# EAGLE design main (EAGLE 9.4.1)
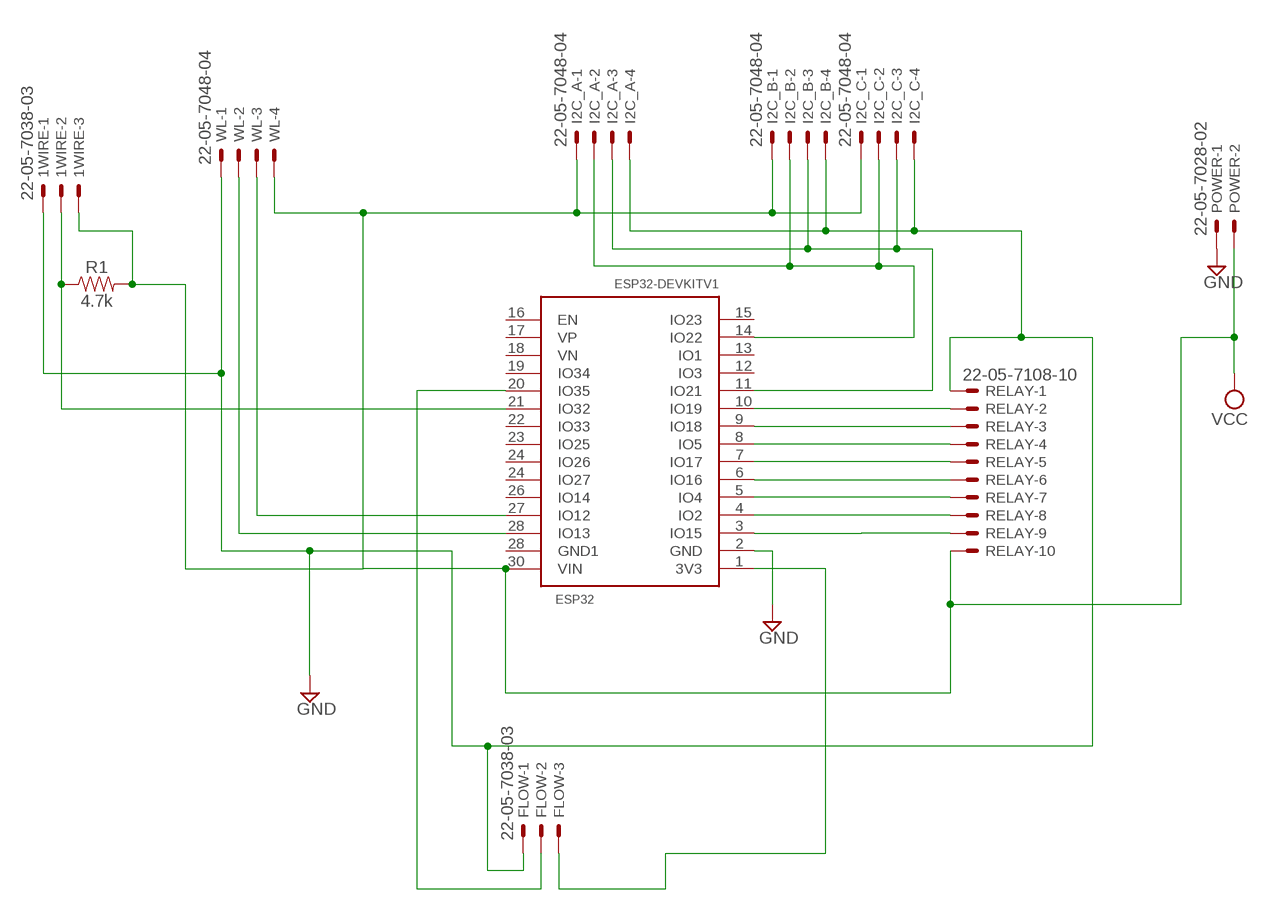
[diagram p0: schematic, sheet 1]

## Parts
1WIRE  22-05-7038-03  [7395-03]
ESP32  ESP32DEVKITV1  [ESP32-DEVKITV1]
FLOW  22-05-7038-03  [7395-03]
I2C_A  22-05-7048-04  [7395-04]
I2C_B  22-05-7048-04  [7395-04]
I2C_C  22-05-7048-04  [7395-04]
POWER  22-05-7028-02  [7395-02]
R1  4.7k  4.7KOHM-0603-1/10W-1%  [0603]
RELAY  22-05-7108-10  [7395-10]
WL  22-05-7048-04  [7395-04]

## Nets
GND: 1WIRE.1 ESP32.2(GND) FLOW.1 I2C_A.4 I2C_B.4 I2C_C.4 POWER.1 RELAY.1 WL.1
N$1: ESP32.3(IO15) RELAY.9
N$2: ESP32.4(IO2) RELAY.8
N$3: ESP32.5(IO4) RELAY.7
N$4: ESP32.6(IO16) RELAY.6
N$5: ESP32.7(IO17) RELAY.5
N$6: ESP32.8(IO5) RELAY.4
N$7: ESP32.9(IO18) RELAY.3
N$8: ESP32.10(IO19) RELAY.2
N$9: ESP32.27(IO12) WL.3
N$10: ESP32.28(IO13) WL.2
N$11: ESP32.11(IO21) I2C_A.3 I2C_B.3 I2C_C.3
N$12: ESP32.14(IO22) I2C_A.2 I2C_B.2 I2C_C.2
N$16: 1WIRE.2 ESP32.21(IO32) R1.1
N$17: ESP32.20(IO35) FLOW.2
N$21: ESP32.1(3V3) FLOW.3
VCC: 1WIRE.3 ESP32.30(VIN) I2C_A.1 I2C_B.1 I2C_C.1 POWER.2 R1.2 RELAY.10 WL.4
Unconnected: ESP32.12(IO3) ESP32.13(IO1) ESP32.15(IO23) ESP32.16(EN) ESP32.17(VP) ESP32.18(VN) ESP32.19(IO34) ESP32.22(IO33) ESP32.23(IO25) ESP32.24(IO26) ESP32.24(IO27) ESP32.26(IO14) ESP32.28(GND1)

## Library data of the parts
1WIRE FLOW = con-molex:22-?-03: CONNECTOR wire to board 2.54 mm (.1 inch) pitch header; MF: MOLEX; OC_FARNELL: unknown; OC_NEWARK: unknown
ESP32 = ESP32-DEVKITV1:ESP32DEVKITV1
I2C_A I2C_B I2C_C WL = con-molex:22-?-04: CONNECTOR wire to board 2.54 mm (.1 inch) pitch header; MF: MOLEX; OC_FARNELL: unknown; OC_NEWARK: unknown
POWER = con-molex:22-?-02: CONNECTOR wire to board 2.54 mm (.1 inch) pitch header; MF: MOLEX; OC_FARNELL: 9731601; OC_NEWARK: unknown
R1 = SparkFun-Resistors:4.7KOHM: 4.7kΩ resistor A resistor is a passive two-terminal electrical component that implements electrical resistance as a circuit element. Resistors act to reduce current flow, and, at the same time, act to lower voltage levels within circuits. - Wikipedia; PROD_ID: RES-07857
RELAY = con-molex:22-?-10: CONNECTOR wire to board 2.54 mm (.1 inch) pitch header; MF: MOLEX; OC_FARNELL: unknown; OC_NEWARK: unknown

## Board
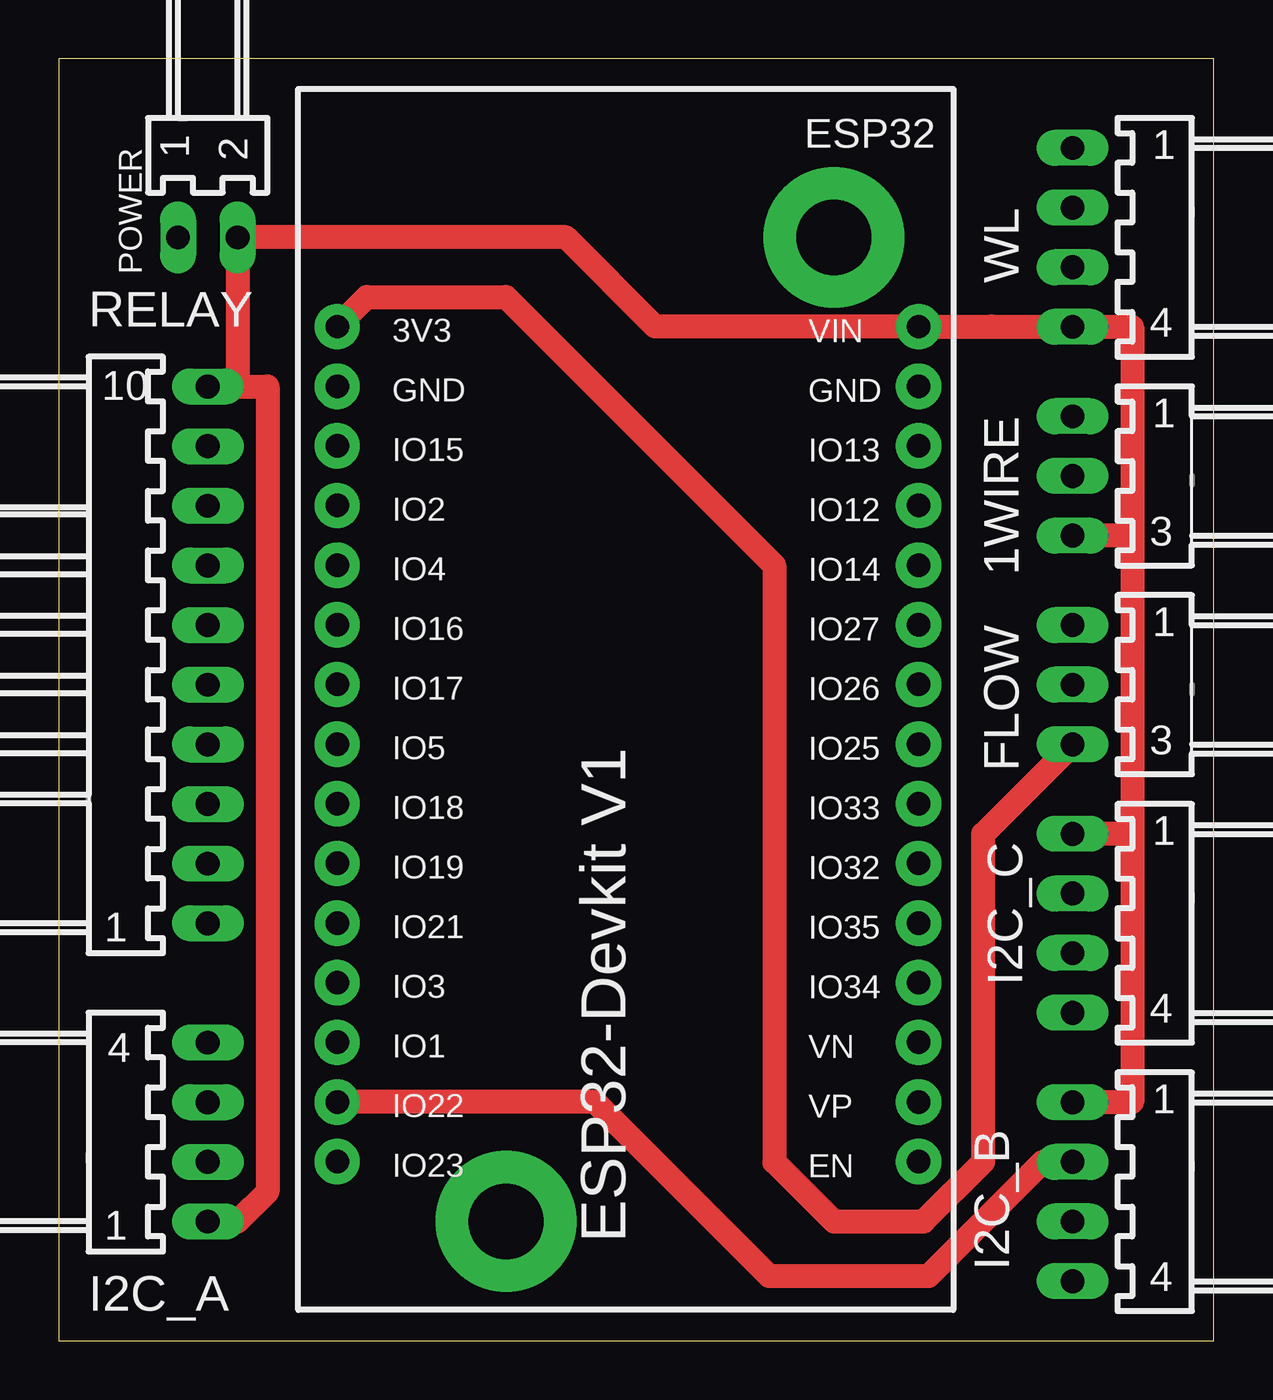
[diagram p1: board, top side]
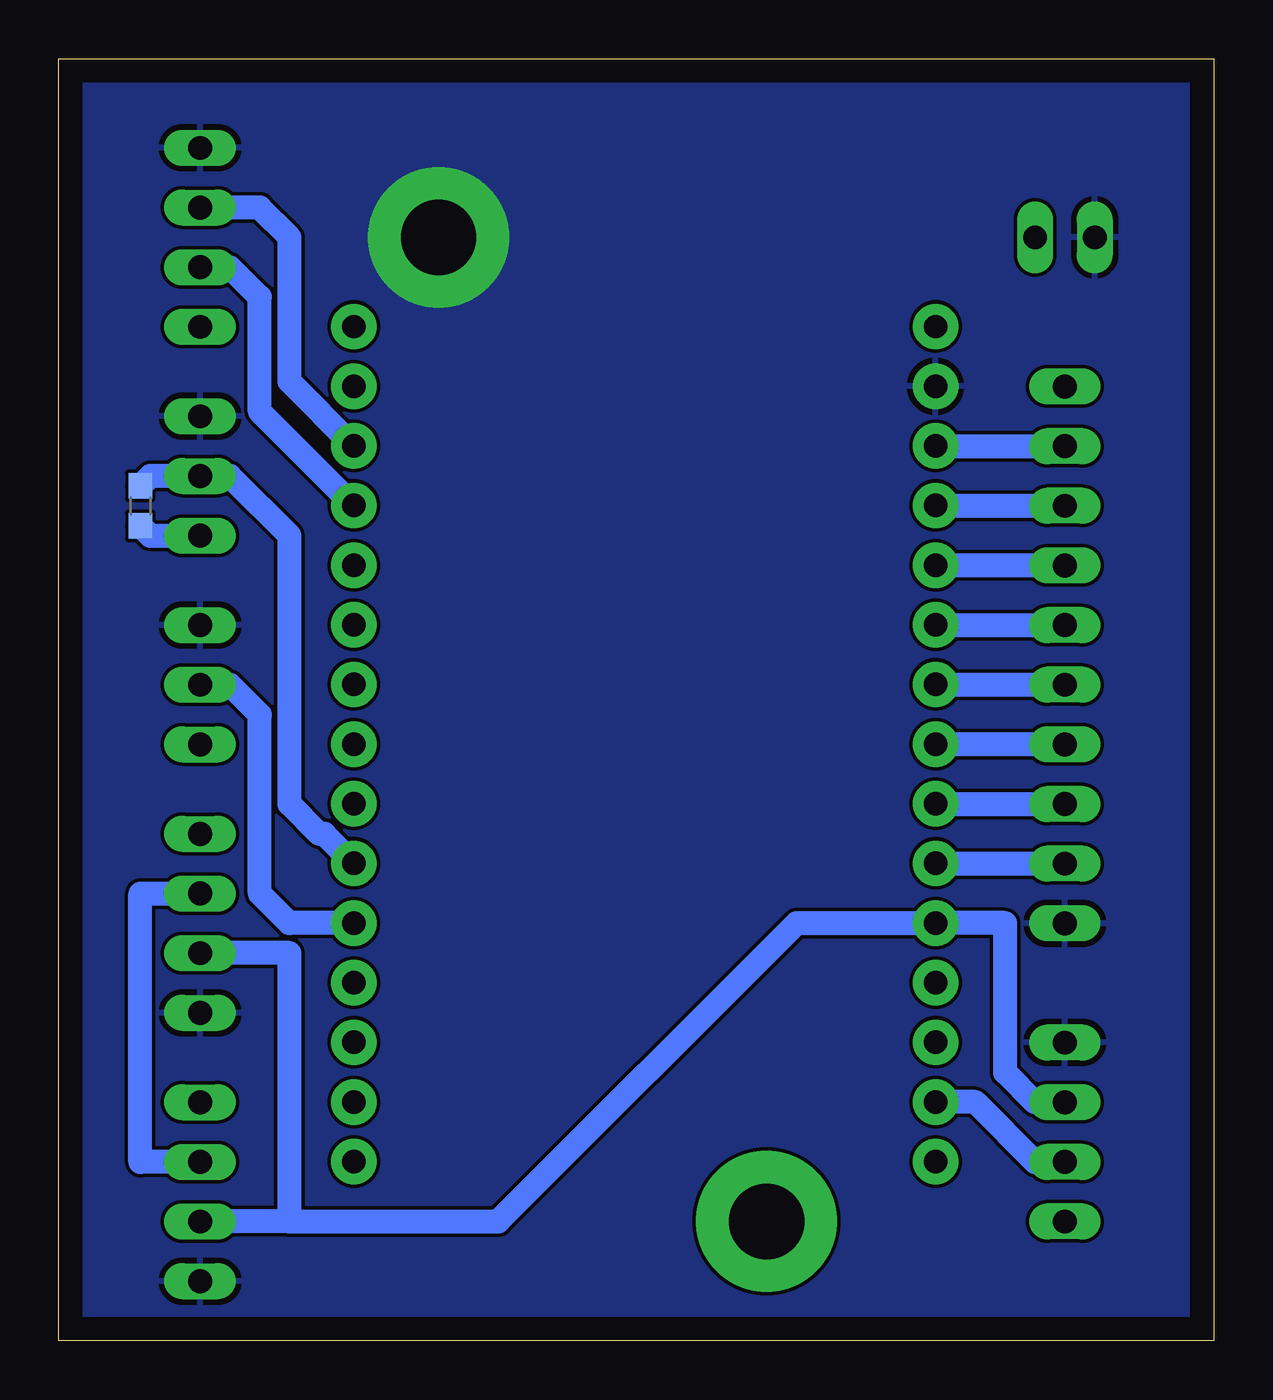
[diagram p2: board, bottom side, seen from below]

Size 49.2 x 54.6 mm. Coordinates in mm from the lower left corner, seen from the top.
Outline: 0,0 49.2,0 49.2,54.6 0,54.6 0,0
Copper layers (1*16): Top 0.035mm / dielectric 1.5mm / Bottom 0.035mm
Design rules "default": minimum track width 6mil, minimum drill 0.35mm, track to track 6mil, track to pad 6mil, pad to pad 6mil, via to via 6mil, smd to smd 6mil, copper to edge 40mil, drill to drill 6mil, minimum pad ring 10mil, minimum via ring 8mil, stop-mask expansion 4mil, vias tented up to drill 0mil, thermal gap 10mil

### Footprints (pad centres in the part's own frame; a part is rotated, then mirrored left to right if it is on the bottom)
7395-03 = drill 1.016 long: 1 2.54,0; 2 0,0; 3 -2.54,0
ESP32-DEVKITV1 = drill 1 pad 1.93: 1 -22.87,-13.54; 2 -20.33,-13.54; 3 -17.79,-13.54; 4 -15.25,-13.54; 5 -12.71,-13.54; 6 -10.17,-13.54; 7 -7.63,-13.54; 8 -5.09,-13.54; 9 -2.55,-13.54; 10 -0.01,-13.54; 11 2.53,-13.54; 12 5.07,-13.54; 13 7.61,-13.54; 14 10.15,-13.54; 15 12.69,-13.54; 16 12.69,11.23; 17 10.15,11.23; 18 7.61,11.23; 19 5.07,11.23; 20 2.53,11.23; 21 -0.01,11.23; 22 -2.55,11.23; 23 -5.09,11.23; 24 -7.63,11.23; 25 -10.17,11.23; 26 -12.71,11.23; 27 -15.25,11.23; 28 -17.79,11.23; 29 -20.33,11.23; 30 -22.87,11.23
7395-04 = drill 1.016 long: 1 3.81,0; 2 1.27,0; 3 -1.27,0; 4 -3.81,0
7395-02 = drill 1.016 long: 1 1.27,0; 2 -1.27,0
0603 = smd 1.1 x 1: 1 -0.85,0; 2 0.85,0
7395-10 = drill 1.016 long: 1 11.43,0; 2 8.89,0; 3 6.35,0; 4 3.81,0; 5 1.27,0; 6 -1.27,0; 7 -3.81,0; 8 -6.35,0; 9 -8.89,0; 10 -11.43,0

### Placement (x,y rotation side)
1WIRE  43.18,36.83 90 top
ESP32  25.4,20.32 270 top
FLOW  43.18,27.94 90 top
I2C_A  6.35,8.89 270 top
I2C_B  43.18,6.35 90 top
I2C_C  43.18,17.78 90 top
POWER  6.35,46.99 180 top
R1  45.72,35.56 270 bottom
RELAY  6.35,29.21 270 top
WL  43.18,46.99 90 top

### Tracks (layer width: path | path; a pad name or v marks a point on that pad's centre or on a via)
GND  (via drill 3.2 pad 6)
  other vias: 33.02,46.99
  pour Bottom: 0,54.61 49.53,54.61 49.53,0 0,0
GND1  (via drill 3.2 pad 6)
  other vias: 19.05,5.08
N$1
  Bottom 1.016: ESP32.3 RELAY.9
N$2
  Bottom 1.016: ESP32.4 RELAY.8
N$3
  Bottom 1.016: RELAY.7 ESP32.5
N$4
  Bottom 1.016: ESP32.6 RELAY.6
N$5
  Bottom 1.016: ESP32.7 RELAY.5
N$6
  Bottom 1.016: ESP32.8 RELAY.4
N$7
  Bottom 1.016: RELAY.3 ESP32.9
N$8
  Bottom 1.016: RELAY.2 ESP32.10
N$9
  Bottom 1.016: ESP32.27 40.64,39.58 40.64,44.45 41.91,45.72 WL.3
N$10
  Bottom 1.016: ESP32.28 39.37,40.85 39.37,46.99 40.64,48.26 WL.2
N$11
  Bottom 1.016: 39.37,5.08 I2C_B.3 | 39.37,5.08 39.37,16.51 I2C_C.3 | I2C_A.3 7.62,10.16 8.89,11.43 8.89,17.78 8.9,17.79 ESP32.11 17.77,17.79 30.48,5.08 39.37,5.08
N$12
  Top 1.016: ESP32.14 22.85,10.17 30.27,2.75 37.04,2.75 41.91,7.62 I2C_B.2
  Bottom 1.016: I2C_B.2 45.72,7.62 45.72,19.05 I2C_C.2 | I2C_A.2 7.62,7.62 10.17,10.17 ESP32.14
N$16
  Bottom 1.016: R1.1 45.3,36.83 1WIRE.2 41.91,36.83 39.37,34.29 39.37,22.86 38.1,21.59 37.89,21.59 ESP32.21
N$17
  Bottom 1.016: FLOW.2 41.91,27.94 40.63,26.66 40.64,26.65 40.64,19.05 39.38,17.79 ESP32.20
N$21
  Top 1.016: ESP32.1 13.12,44.45 19.05,44.45 30.48,33.02 30.48,7.62 33.02,5.08 36.83,5.08 39.37,7.62 39.37,21.59 FLOW.3
VCC
  Top 1.016: RELAY.10 7.62,40.64 | 7.62,40.64 8.89,40.64 8.89,6.35 7.62,5.08 I2C_A.1 | 7.62,40.64 POWER.2 21.6,46.99 25.4,43.19 ESP32.30 39.73,43.19 39.73,43.18 WL.4 45.72,43.18 45.72,34.29 | 45.72,34.29 45.72,21.59 | 45.72,21.59 45.72,10.16 I2C_B.1 | 45.72,21.59 I2C_C.1 | 45.72,34.29 1WIRE.3
  Bottom 1.016: R1.2 45.3,34.29 1WIRE.3